# Altium schematic sheet Hot-Swap_Solutions.SchDoc
size A
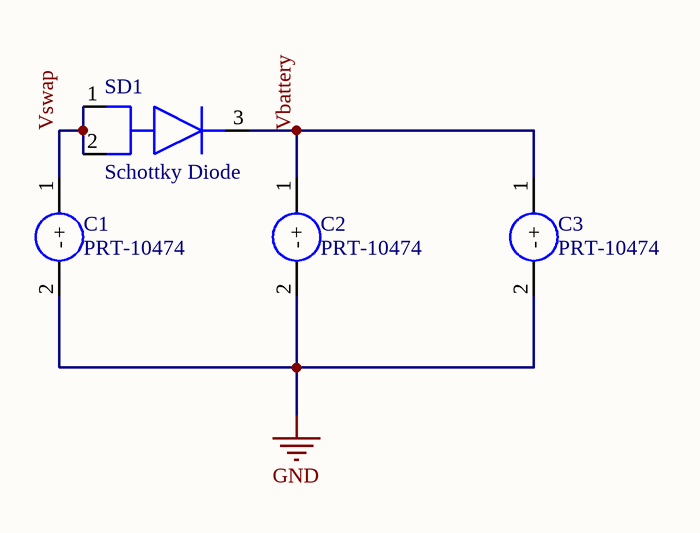
[diagram p0: Hot-Swap_Solutions.SchDoc]

## Parts
C1  PRT-10474  [XT60 CONNECTOR REPLACEMENT]
C2  PRT-10474  [XT60 CONNECTOR REPLACEMENT]
C3  PRT-10474  [XT60 CONNECTOR REPLACEMENT]
SD1  Schottky Diode  [Schottky Barrier Diode]

## Nets
GND: C1.2(-) C2.2(-) C3.2(-)
Vbattery: C2.1(+) C3.1(+) SD1.3
Vswap: C1.1(+) SD1.1 SD1.2

## Library data of the parts
C1-C3 = PRT-10474: XT60 CONNECTORS MALE/FEMALE PAIR; Manufacturer: SparkFun; Supplier 1: Digi-Key; Supplier Part Number 1: 1568-1816-ND; Manufacturer Part Number: PRT-10474; RoHS: No; Stock 1: 2291; Pricing 1: 1=1.50000 (USD); ComponentLink1URL: https://cdn.sparkfun.com/datasheets/Prototyping/xt60.pdf?src-supplier=Digi-Key; ComponentLink1Description: https://cdn.sparkfun.com/datasheets/Prototyping/xt60.pdf?src-supplier=Digi-Key
SD1 = RB228NS-40FHTL: Manufacturer: Rohm; Element Configuration: Common Cathode; Max Reverse Voltage (DC): 40V; Average Rectified Current: 30A; Supplier 1: Digi-Key; Supplier Part Number 1: RB228NS-40FHTLCT-ND; Manufacturer Part Number: RB228NS-40FHTL; RoHS: No; Stock 1: 969; Pricing 1: 1=1.73000, 10=1.55700, 25=1.46920, 100=1.14580, 250=1.11644, 500=0.96954 (USD); Mount: Surface Mount; Case/Package: TO-263-3; Packaging: Tape and Reel; ComponentLink1URL: https://www.rohm.com/datasheet/RB228NS-40FH/rb228ns-40fhtl-e?src-supplier=Digi-Key; ComponentLink1Description: https://www.rohm.com/datasheet/RB228NS-40FH/rb228ns-40fhtl-e?src-supplier=Digi-Key